# EAGLE design ZenithWatch (EAGLE 7.4.0)
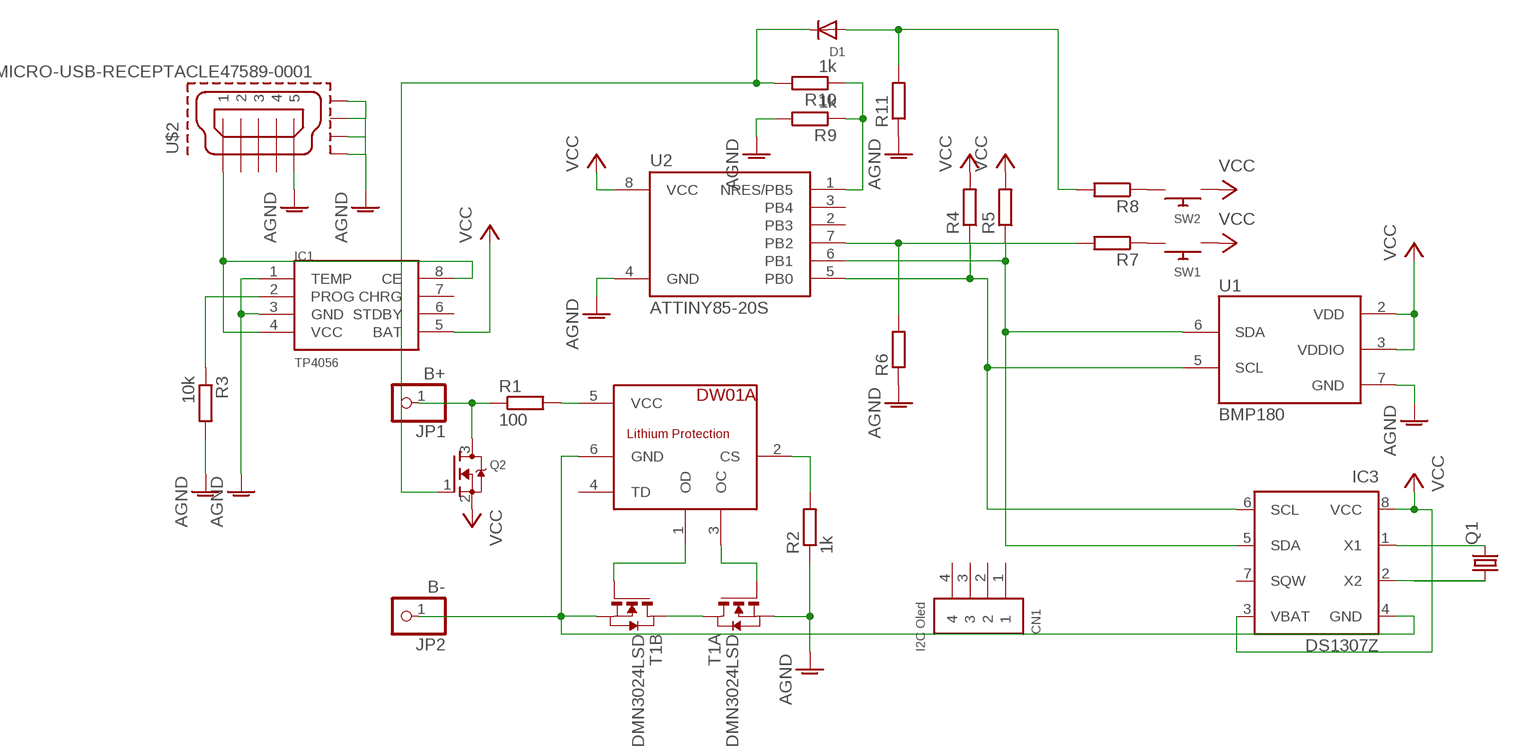
[diagram p0: schematic, sheet 1]

## Parts
CN1  I2C Oled  1X4-BIG  [1X04-BIG]
D1  DIODESOT23_REFLOW  [SOT23-R]
IC1  TP4056  [SOP-8]
IC3  DS1307Z  [SOIC8]
JP1  B+  PINHD-1X1  [1X01]
JP2  B-  PINHD-1X1  [1X01]
Q1  CRYSTALCTS406  [CTS406]
Q2  MOSFET-NREFLOW  [SOT23]
R1  100  R-EU_R0603  [R0603]
R2  1k  R-EU_R0603  [R0603]
R3  10k  R-EU_R0603  [R0603]
R4  R-EU_R0603  [R0603]
R5  R-EU_R0603  [R0603]
R6  R-EU_R0603  [R0603]
R7  R-EU_R0603  [R0603]
R8  R-EU_R0603  [R0603]
R9  1k  R-EU_R0603  [R0603]
R10  1k  R-EU_R0603  [R0603]
R11  R-EU_R0603  [R0603]
SW1  SWITCH_PUSHBUTTONC&K_KSS  [BTN_CK_KSS]
SW2  SWITCH_PUSHBUTTONC&K_KSS  [BTN_CK_KSS]
T1  DMN3024LSD  [TSSOP-8]
U1  BMP180  [BMP180]
U2  ATTINY85-20S  [SOIC8_EIAJ_208MIL]
U$1  DW01A  [SOT23-6]
U$2  MICRO-USB-RECEPTACLE47589-0001  [47589-0001]

## Nets
AGND: IC1.1(TEMP) IC1.3(GND) R2.1 R3.2 R6.1 R9.2 R11.1 T1.2(A:S) T1.3(A:S) U1.7(GND) U2.4(GND) U$2.5 U$2.CASING1(GND1) U$2.CASING2(GND2) U$2.CASING3(GND3) U$2.CASING4(GND4)
N$1: T1.4(A:G) U$1.3(OC)
N$2: T1.5(B:G) U$1.1(OD)
N$3: T1.1(A:D) T1.8(B:D)
N$4: R2.2 U$1.2(CS)
N$5: IC3.4(GND) JP2.1 T1.6(B:S) T1.7(B:S) U$1.6(GND)
N$6: R1.2 U$1.5(VCC)
N$7: IC1.2(PROG) R3.1
N$8: IC3.5(SDA) R5.1 U1.6(SDA) U2.6(PB1)
N$9: IC1.4(VCC) IC1.8(CE) U$2.1
N$10: IC3.6(SCL) R4.1 U1.5(SCL) U2.5(PB0)
N$11: R7.1 SW1.P$2
N$12: R8.1 SW2.P$2
N$13: R6.2 R7.2 U2.7(PB2)
N$14: IC3.1(X1) Q1.3
N$15: IC3.2(X2) Q1.1
N$17: JP1.1 Q2.3(D) R1.1
N$18: R9.1 R10.1 U2.1(NRES/PB5)
N$19: D1.3(C) Q2.1(G) R10.2
N$22: D1.1(A) R8.2 R11.2
VCC: IC1.5(BAT) IC3.3(VBAT) IC3.8(VCC) Q2.2(S) R4.2 R5.2 SW1.P$1 SW2.P$1 U1.2(VDD) U1.3(VDDIO) U2.8(VCC)
Unconnected: CN1.1 CN1.2 CN1.3 CN1.4 IC1.6(STDBY) IC1.7(CHRG) IC3.7(SQW) U2.2(PB3) U2.3(PB4) U$1.4(TD) U$2.2 U$2.3 U$2.4

## Library data of the parts
CN1 = adafruit:1X4: 4-pin connector
D1 = adafruit:DIODE: Diode SMADIODE - SMA Surface Mount Package 20V 1A Schottky Diode Digikey: 641-1014-6-ND DO-1N4148 - Through Hole Small Current Diode SOD-123 20V 1 A (.5mV Vf) Schottky Diode - Digikey: MBRX120TPMSCT-ND SOD-323 10V 570mA (.38mV Vf, 3ns) Schottky Diode - Digikey: ZLLS410CT-ND SOD-523 30V 30mA Schottky Diode (RB751S-40TE61) - Digikey: RB751S-40TE61CT-ND SOT23-R/W - SOT23 Package (R = Solder Paste/Reflow Ovens, W = Hand-Soldering) BAT54Film 40V 300mA - Digikey: 497-7162-1-ND
IC1 = TP4056:TP4056
IC3 = ds1307_pcf8583:DS1307: I2C-Bus CLOCK/CALENDAR
JP1 JP2 = pinhead:PINHD-1X1: PIN HEADER
Q1 = adafruit:CRYSTAL: CRYSTAL; OC_FARNELL: unknown; OC_NEWARK: unknown
Q2 = adafruit:MOSFET-N: N-Channel Mosfet 2N7002E - 60V 260mA SOT23 [Digikey: 2N7002ET1GOSTR-ND] - REEL BSH103 - 30V 850mA SOT23 [Digikey: 568-5013-1-ND]
R1-R11 = rcl:R-EU_: RESISTOR, European symbol
SW1 SW2 = adafruit:SWITCH_PUSHBUTTON: Buttons SOFTTOUCHSMD_SJ - Soft touch temporary push button (Super Junk Akihabara) Compatible with SKPMANE010 [Mouser: 688-SKPMAN] C&K_KSS = Digikey: KSS221GLFS
T1 = FS8205A:DMN3024LSD: DUAL N-CHANNEL ENHANCEMENT MODE MOSFET data sheet <http://goo.gl/dRgboR> Dave.Calaway Eagle Library <https://goo.gl/Muy1Tr>
U1 = BMP180:BMP180: BOSCH BMP180 DIGITAL BAROMETRIC PRESSURE SENSOR Web page: http://www.bosch-sensortec.com/en/homepage/products_3/environmental_sensors_1/bmp180_1/bmp180 Datasheet: http://ae-bst.resource.bosch.com/media/products/dokumente/bmp180/BST-BMP180-DS000-09.pdf The BMP180 is the function compatible successor of the BMP085, a new generation of high precision digital pressure sensors for consumer applications. The ultra-low power, low voltage electronics of the BMP180 is optimized for use in mobile phones, PDAs, GPS navigation devices and outdoor equipment. With a low altitude noise of merely 0.25m at fast conversion time, the BMP180 offers superior performance. The I2C interface allows for easy system integration with a microcontroller. The BMP180 is based on piezo-resistive technology for EMC robustness, high accuracy and linearity as well as long term stability. Key features: - Temperature measurement included - I2C interface - Fully calibrated - Pb-free, halogen-free and RoHS compliant, - MSL 1 Basic specs: Pressure range: 300 to 1100hPa (+9000m to -500m relating to sea level) Supply voltage: 1.8 to 3.6V (VDD), 1.62V to 3.6V (VDDIO) Package: LGA package with metal lid Small footprint: 3.6mm x 3.8mm Super-flat: 0.93mm height Low power: 5µA at 1 sample / sec. in standard mode Low noise: 0.06hPa (0.5m) in ultra low power mode, 0.02hPa (0.17m) advanced resolution mode Typical applications: - Enhancement of GPS navigation (dead-reckoning, slope detection, etc.) - In- and out-door navigation - Leisure and sports - Weather forecast - Vertical velocity indication (rise/sink speed)
U2 = _hhn_attiny25_45_85:ATTINY85*: ATMEL ATtiny 85 Packages: P = PDIP 08 30mil S = SOIC 08 EIAJ 208mil Technologies Note: for complete ordering code (temp. range, finish, tape&reel etc.) see www.atmel.com • Supply Voltage: V = (1.8…5.5)V | [blank] = (2.7…5.5)V • Speed: 10 = 10 MHz | 20 = 20 MHz Author: Dipl.-Ing. FH Rainer Bayer HHN Hochschule Heilbronn (Heilbronn University), rainer.bayer@hs-heilbronn.de Ingenieurbüro ing-rb, mail@ing-rb.de
U$1 = DW01a:DW01A
U$2 = con-molex-usb:MICRO-USB-RECEPTACLE: MICRO USB RECEPTACLES Micro-USB Receptacles, SMT, Lead-Free from MOLEX <http://www.molex.com/>. (C) 2014 Tomasz Boleslaw CEDRO, cederom@tlen.pl, http://www.tomek.cedro.info. Version 0.1 (2014-01-17): Initial release. Version 0.2 (2014-02-06): Updated 47589-0001 footprint pins/pads/milling. Following devices are included: 1. 47589-0001 Micro-USB AB Receptacle, Bottom Mount, SMT, Lead-Free <http://www.molex.com/molex/products/datasheet.jsp?part=active/0475890001_IO_CONNECTORS.xml> (Technical Drawing <http://www.molex.com/pdm_docs/sd/475890001_sd.pdf>).

## Board
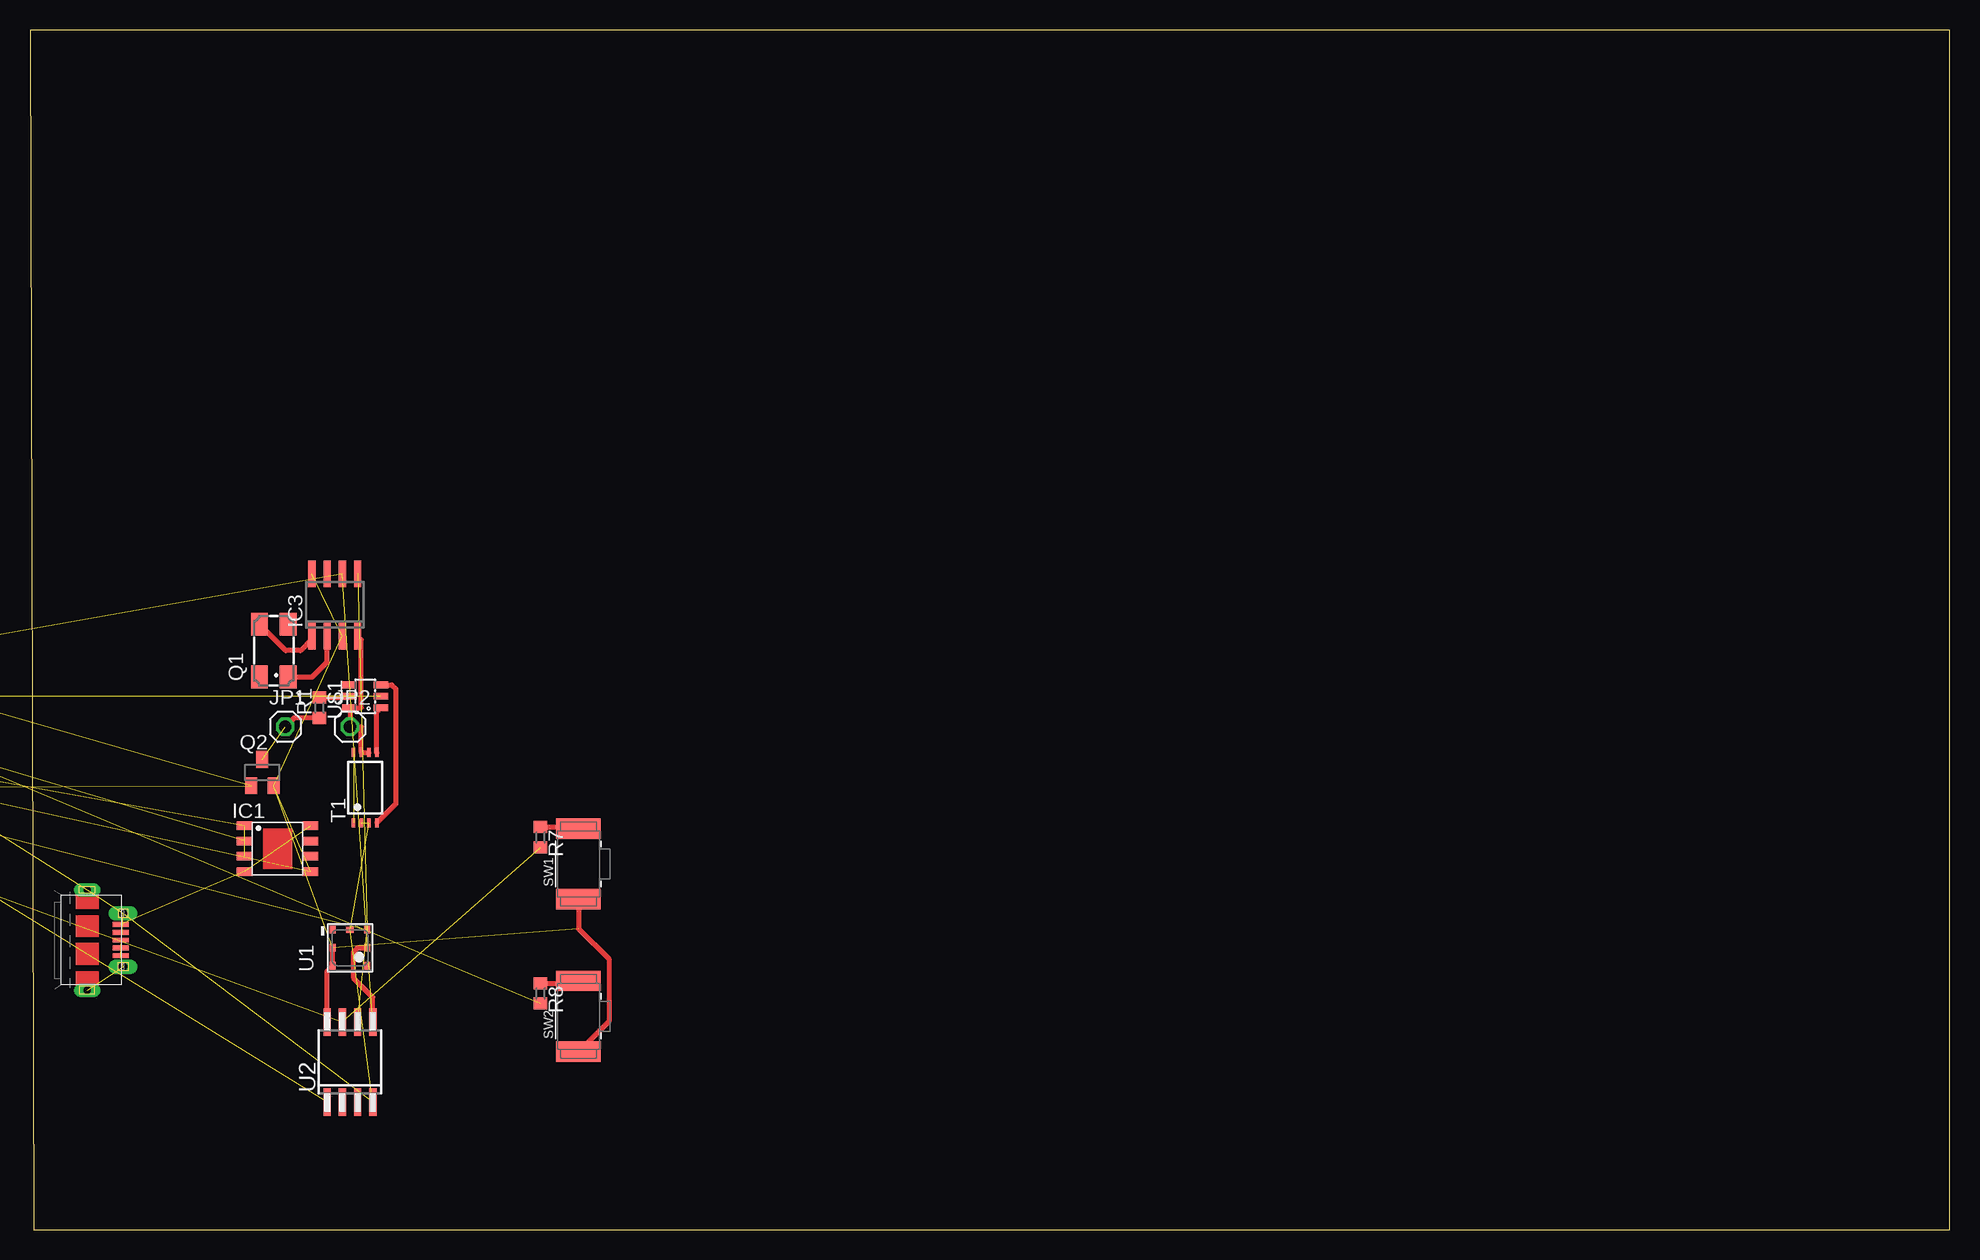
[diagram p1: board, top side]

Size 160 x 100 mm. Coordinates in mm from the lower left corner, seen from the top.
Outline: 0.32,0 160,0 160,100 0,100 0.32,0
Copper layers (1*16): Top 0.035mm / dielectric 1.5mm / Bottom 0.035mm
Design rules "default": minimum track width 10mil, minimum drill 24mil, track to track 8mil, track to pad 8mil, pad to pad 8mil, via to via 8mil, smd to smd 8mil, copper to edge 40mil, drill to drill 8mil, minimum pad ring 10mil, minimum via ring 8mil, stop-mask expansion 4mil, vias tented up to drill 0mil, thermal gap 10mil

### Footprints (pad centres in the part's own frame; a part is rotated, then mirrored left to right if it is on the bottom)
1X04-BIG = drill 1.016 pad 1.778: 1 0,0; 2 2.54,0; 3 5.08,0; 4 7.62,0
SOT23-R = smd 0.6 x 0.7: 1 -0.95,-1; 2 0.95,-1; 3 0,1
SOP-8 = smd 1.3 x 0.7: 1 -2.75,1.905; 2 -2.75,0.635; 3 -2.75,-0.635; 4 -2.75,-1.905; 5 2.75,-1.905; 6 2.75,-0.635; 7 2.75,0.635; 8 2.75,1.905
SOIC8 = smd 0.6 x 2.2: 1 -1.905,-2.6; 2 -0.635,-2.6; 3 0.635,-2.6; 4 1.905,-2.6; 5 1.905,2.6; 6 0.635,2.6; 7 -0.635,2.6; 8 -1.905,2.6
1X01 = drill 1.016 octagon: 1 0,0
CTS406 = smd 1.9 x 1.4: 1 -2.2,-1.2; 2 2.2,-1.2; 3 2.2,1.2; 4 -2.2,1.2
SOT23 = smd 1 x 1.4: 1 -0.95,-1.1; 2 0.95,-1.1; 3 0,1.1
R0603 = smd 1 x 1.1: 1 -0.85,0; 2 0.85,0
BTN_CK_KSS = smd 1.7 x 3.7: P$1 -2.95,0; P$2 2.95,0
TSSOP-8 = smd 0.3 x 0.75: 1 -0.975,-2.925; 2 -0.325,-2.925; 3 0.325,-2.925; 4 0.975,-2.925; 5 0.975,2.925; 6 0.325,2.925; 7 -0.325,2.925; 8 -0.975,2.925
BMP180 = smd 0.6 x 0.5: 1 1.5,1.45; 2 0,1.45; 3 -1.5,1.45; 4 -1.5,-1.45; 5 0,-1.45; 6 1.5,-1.45 | smd 0.5 x 0.6: 7 1.5,0
SOIC8_EIAJ_208MIL = smd 0.6 x 2.286: 1 -1.905,-3.33; 2 -0.635,-3.33; 3 0.635,-3.33; 4 1.905,-3.33; 5 1.905,3.33; 6 0.635,3.33; 7 -0.635,3.33; 8 -1.905,3.33
SOT23-6 = smd 0.55 x 1.2: 1 -0.95,-1.3; 2 0,-1.3; 3 0.95,-1.3; 4 0.95,1.3; 5 0,1.3; 6 -0.95,1.3
47589-0001 = smd 1.35 x 0.4: 1 2.8,1.3; 2 2.8,0.65; 3 2.8,0; 4 2.8,-0.65; 5 2.8,-1.3 | drill 0.6 pad 0.95 long: CASING1 0,4.175; CASING2 0,-4.175 | drill 0.7 pad 1.1 long: CASING3 3,2.225; CASING4 3,-2.225

### Placement (x,y rotation side)
CN1  -22.86,30.48 0 top  (outside the outline)
D1  -24.13,48.26 0 top  (outside the outline)
IC1  20.64,31.75 0 top
IC3  25.4,52.07 0 top
JP1  21.27,41.91 0 top
JP2  26.67,41.91 0 top
Q1  20.32,48.26 90 top
Q2  19.37,38.1 0 top
R1  24.13,43.5 90 top
R2  -25.4,44.45 0 top  (outside the outline)
R3  -21.59,44.45 0 top  (outside the outline)
R4  -38.1,43.18 0 top  (outside the outline)
R5  -41.91,43.18 0 top  (outside the outline)
R6  -45.72,43.18 0 top  (outside the outline)
R7  42.55,32.7 270 top
R8  42.55,19.68 270 top
R9  -29.21,44.45 0 top  (outside the outline)
R10  -45.72,36.83 0 top  (outside the outline)
R11  -34.29,43.18 0 top  (outside the outline)
SW1  45.72,30.48 90 top
SW2  45.72,17.78 90 top
T1  27.94,36.83 0 top
U1  26.67,23.5 90 top
U2  26.67,13.97 0 top
U$1  27.94,44.45 90 top
U$2  4.76,24.13 0 top

### Tracks (layer width: path | path; a pad name or v marks a point on that pad's centre or on a via)
AGND  (15 unrouted)
N$1
  Top 0.406: U$1.3 30.16,45.4 30.48,45.09 30.48,35.47 T1.4
N$2
  Top 0.406: T1.5 28.89,39.76 28.89,43.15 U$1.1
N$3  (1 unrouted)
N$4  (1 unrouted)
N$5
  Top 0.406: T1.6 T1.7 27.62,41.91 JP2.1 26.67,43.5 U$1.6 27.62,43.5 27.62,49.15 IC3.4
N$6
  Top 0.406: R1.2 26.54,44.35 U$1.5
N$7  (1 unrouted)
N$8  (3 unrouted)
N$9  (2 unrouted)
N$10  (2 unrouted)
  Top 0.406: U2.5 28.57,19.37 26.99,20.95 26.99,23.18 27.3,23.5 U1.5
N$11
  Top 0.406: R7.1 45.6,33.55 SW1.P$2
N$12
  Top 0.406: R8.1 45.52,20.54 SW2.P$2
N$13  (2 unrouted)
N$14
  Top 0.406: IC3.1 23.5,49.21 22.54,48.26 21.32,48.26 Q1.3
N$15
  Top 0.406: Q1.1 23.52,46.06 24.77,47.31 IC3.2
N$17  (1 unrouted)
  Top 0.406: R1.1 22.01,42.65 JP1.1
N$18  (2 unrouted)
N$19  (2 unrouted)
N$22  (2 unrouted)
VCC  (7 unrouted)
  Top 0.406: SW1.P$1 45.72,25.08 48.26,22.54 48.26,17.37 SW2.P$1 | U2.8 24.77,21.54 U1.3 U1.2